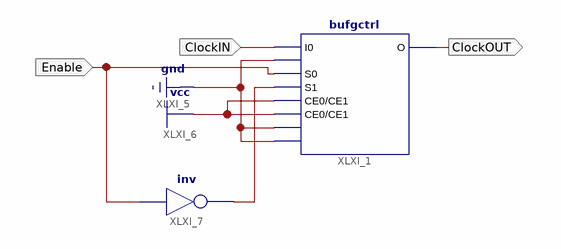
[diagram p0: schematic sheet 1]
// Xilinx ISE schematic Clock400Gate.sch (virtex4) as structural Verilog: 2 symbols, 3 ports
module Clock400Gate (
  input  ClockIN,
  input  Enable,
  output ClockOUT
);

  wire XLXN_18;

  bufgctrl XLXI_1 (
    .I0(ClockIN), .I1(1'b0), .S0(Enable), .S1(XLXN_18), .CE0(1'b1), .CE1(1'b1), .IGNORE0(1'b0),
    .IGNORE1(1'b0), .O(ClockOUT));
  not XLXI_7 (XLXN_18, Enable);
endmodule
